# Altium schematic sheet LED_BAT_breakout.SchDoc
size 100 x 100 mm; SheetNumber: 1; SheetTotal: 1
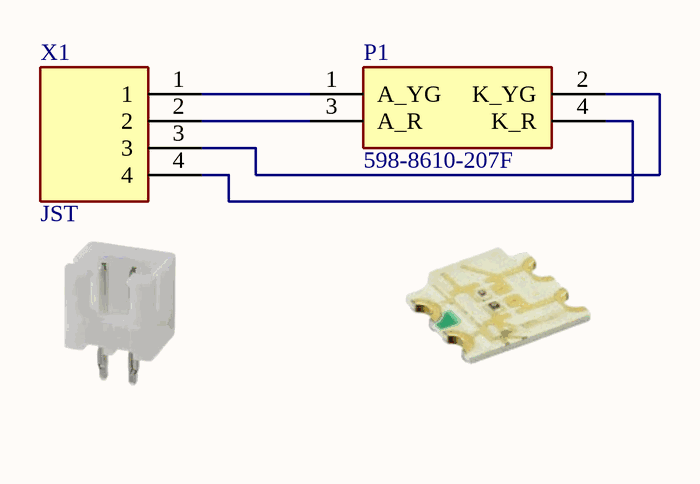
[diagram p0: LED_BAT_breakout.SchDoc]

## Parts
P1  598-8610-207F  [5988610207F]
X1  JST  [Header 4pin 2,54mm]

## Nets
NetP1_1: P1.1(A_YG) X1.1
NetP1_2: P1.2(K_YG) X1.3
NetP1_3: P1.3(A_R) X1.2
NetP1_4: P1.4(K_R) X1.4

## Library data of the parts
P1 = 598-8610-207F: LED; Manufacturer_Name: Dialight; Datasheet Link: https://media.digikey.com/pdf/Data%20Sheets/Dialight%20PDFs/598%20Series%201210%20Pkg%20Bi-Color.pdf; Height: 0.8mm; Manufacturer_Part_Number: 598-8610-207F; Mouser Part Number: 645-598-8610-207F; Mouser Price/Stock: https://www.mouser.co.uk/ProductDetail/Dialight/598-8610-207F?qs=7JStj%2FjQ2SFuCjosqwklHQ%3D%3D; Arrow Part Number: 598-8610-207F; Arrow Price/Stock: https://www.arrow.com/en/products/598-8610-207f/dialight?region=nac
X1 = B4B-XH-AM__LF__SN_: Connector; Manufacturer_Name: JST (JAPAN SOLDERLESS TERMINALS); Manufacturer_Part_Number: B4B-XH-AM (LF)(SN); Datasheet Link: http://www.jst-mfg.com/product/pdf/eng/eXH.pdf; Height: 7mm; Arrow Part Number: B4B-XH-AM (LF)(SN); Arrow Price/Stock: https://www.arrow.com/en/products/b4b-xh-am-lf-sn/jst-manufacturing?region=europe